# Altium schematic sheet sch-contacts.SchDoc
size 127 x 127 mm
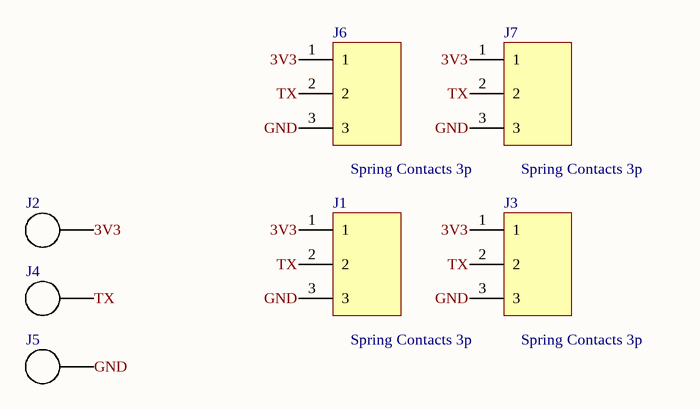
[diagram p0: sch-contacts.SchDoc]

## Parts
J1  Spring Contacts 3p  [70ABJ-3-M0E]
J2  pad single  [PAD_SING]  (value not drawn)
J3  Spring Contacts 3p  [70ABJ-3-M0E]
J4  pad single  [PAD_SING]  (value not drawn)
J5  pad single  [PAD_SING]  (value not drawn)
J6  Spring Contacts 3p  [70ABJ-3-M0E]
J7  Spring Contacts 3p  [70ABJ-3-M0E]

## Nets
3V3: J1.1 J1.6 J2.1 J3.1 J3.6 J6.1 J6.6 J7.1 J7.6
GND: J1.3 J1.4 J3.3 J3.4 J5.1 J6.3 J6.4 J7.3 J7.4
TX: J1.2 J1.5 J3.2 J3.5 J4.1 J6.2 J6.5 J7.2 J7.5

## Library data of the parts
J1 J3 J6 J7 = ‎70ABJ-3-M0E‎: Spring loaded electrical contacts
J2 J4 J5 = PAD-SING